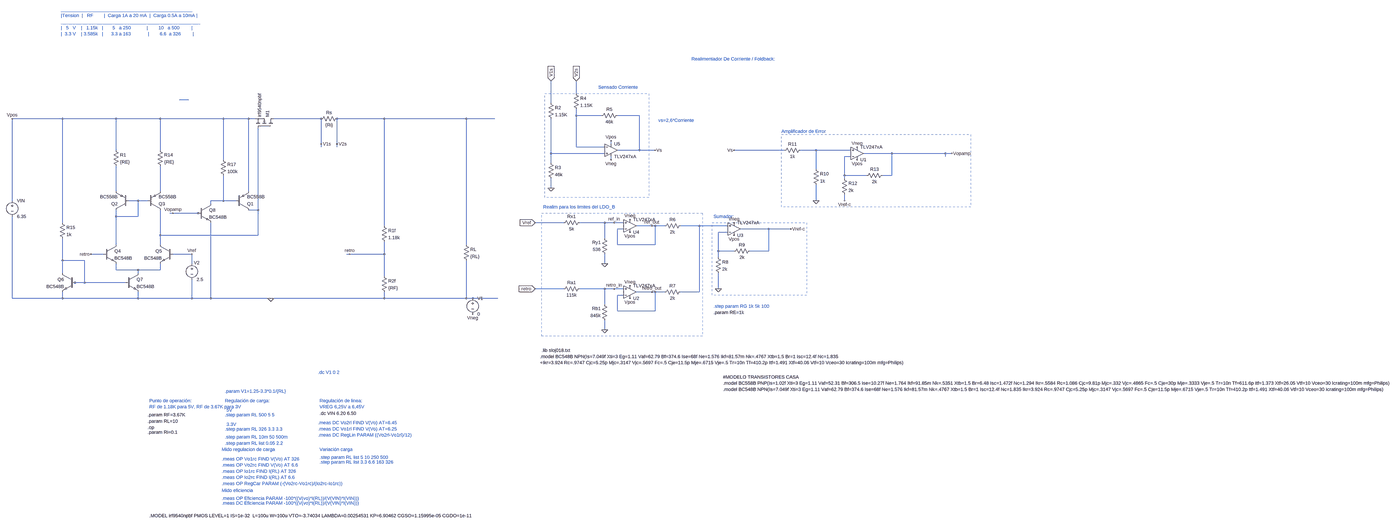
[diagram p0: schematic 2024-09-15 LDO con opamps TLV.asc, whole sheet]
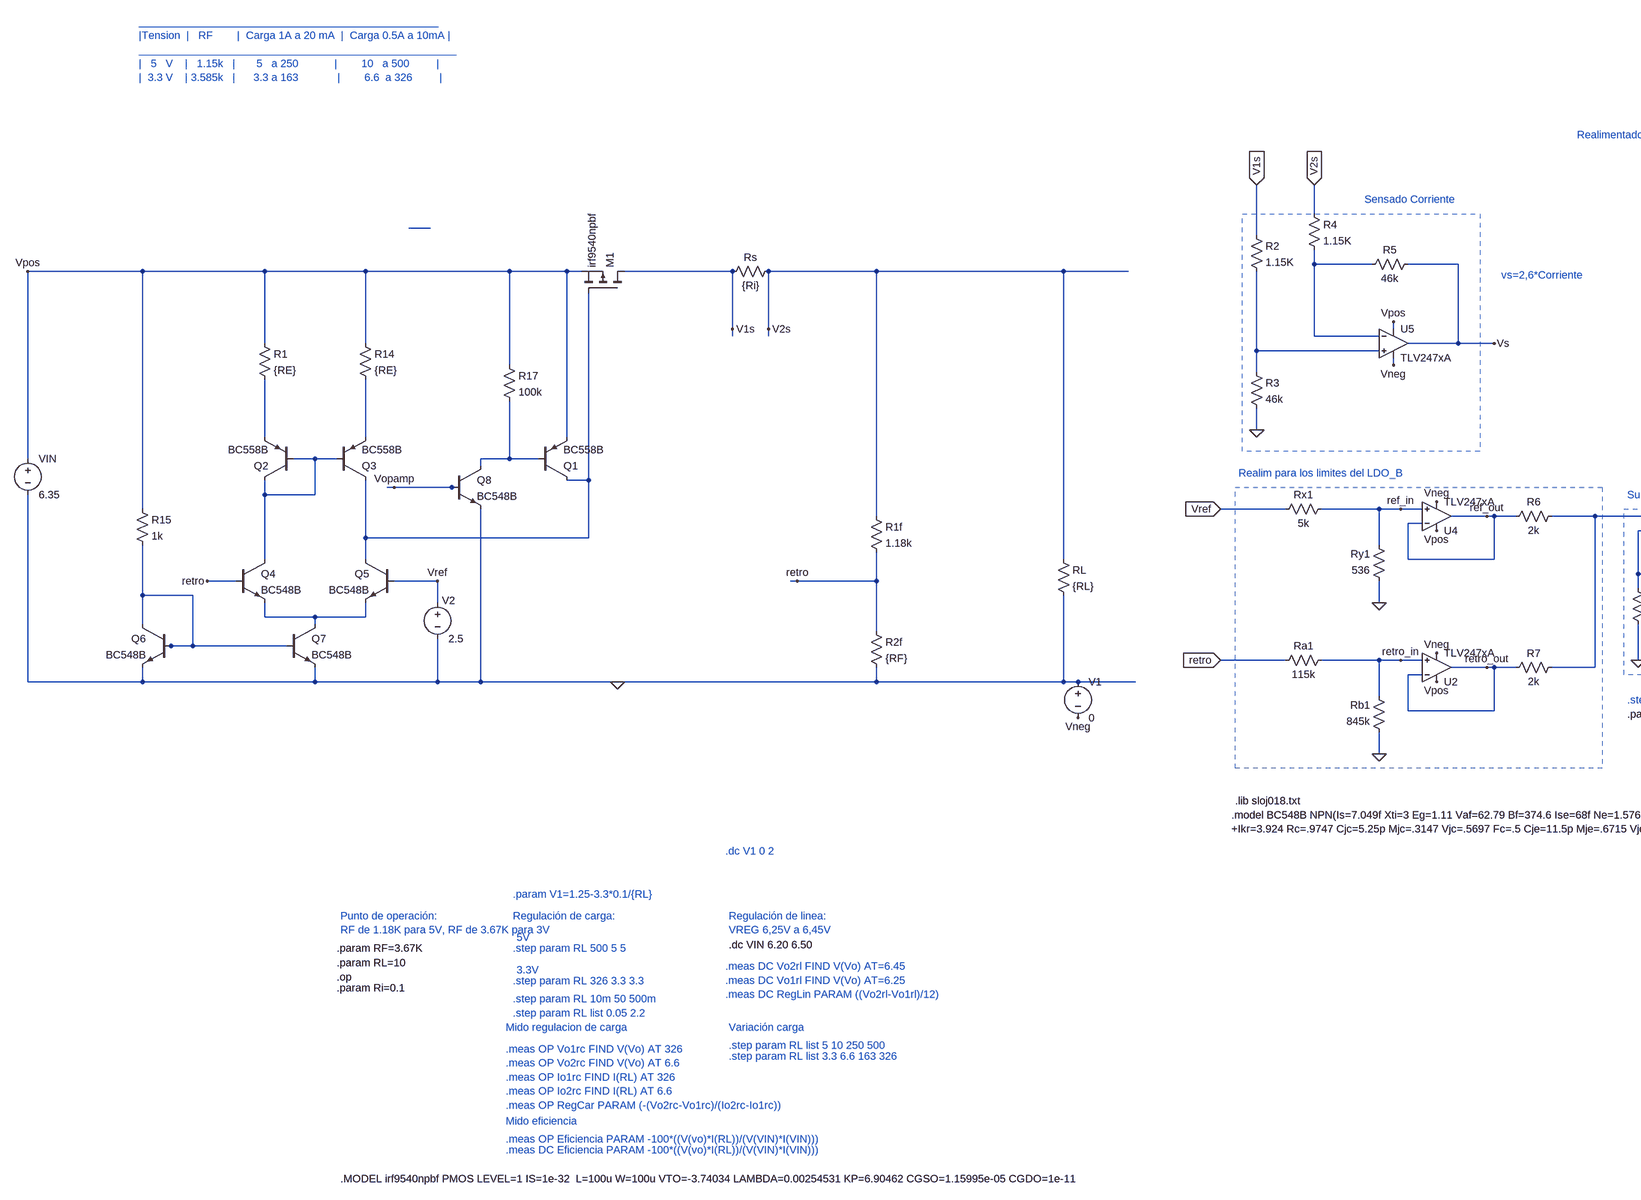
[diagram p1: schematic 2024-09-15 LDO con opamps TLV.asc, part, row 1 of 1, column 1 of 2]
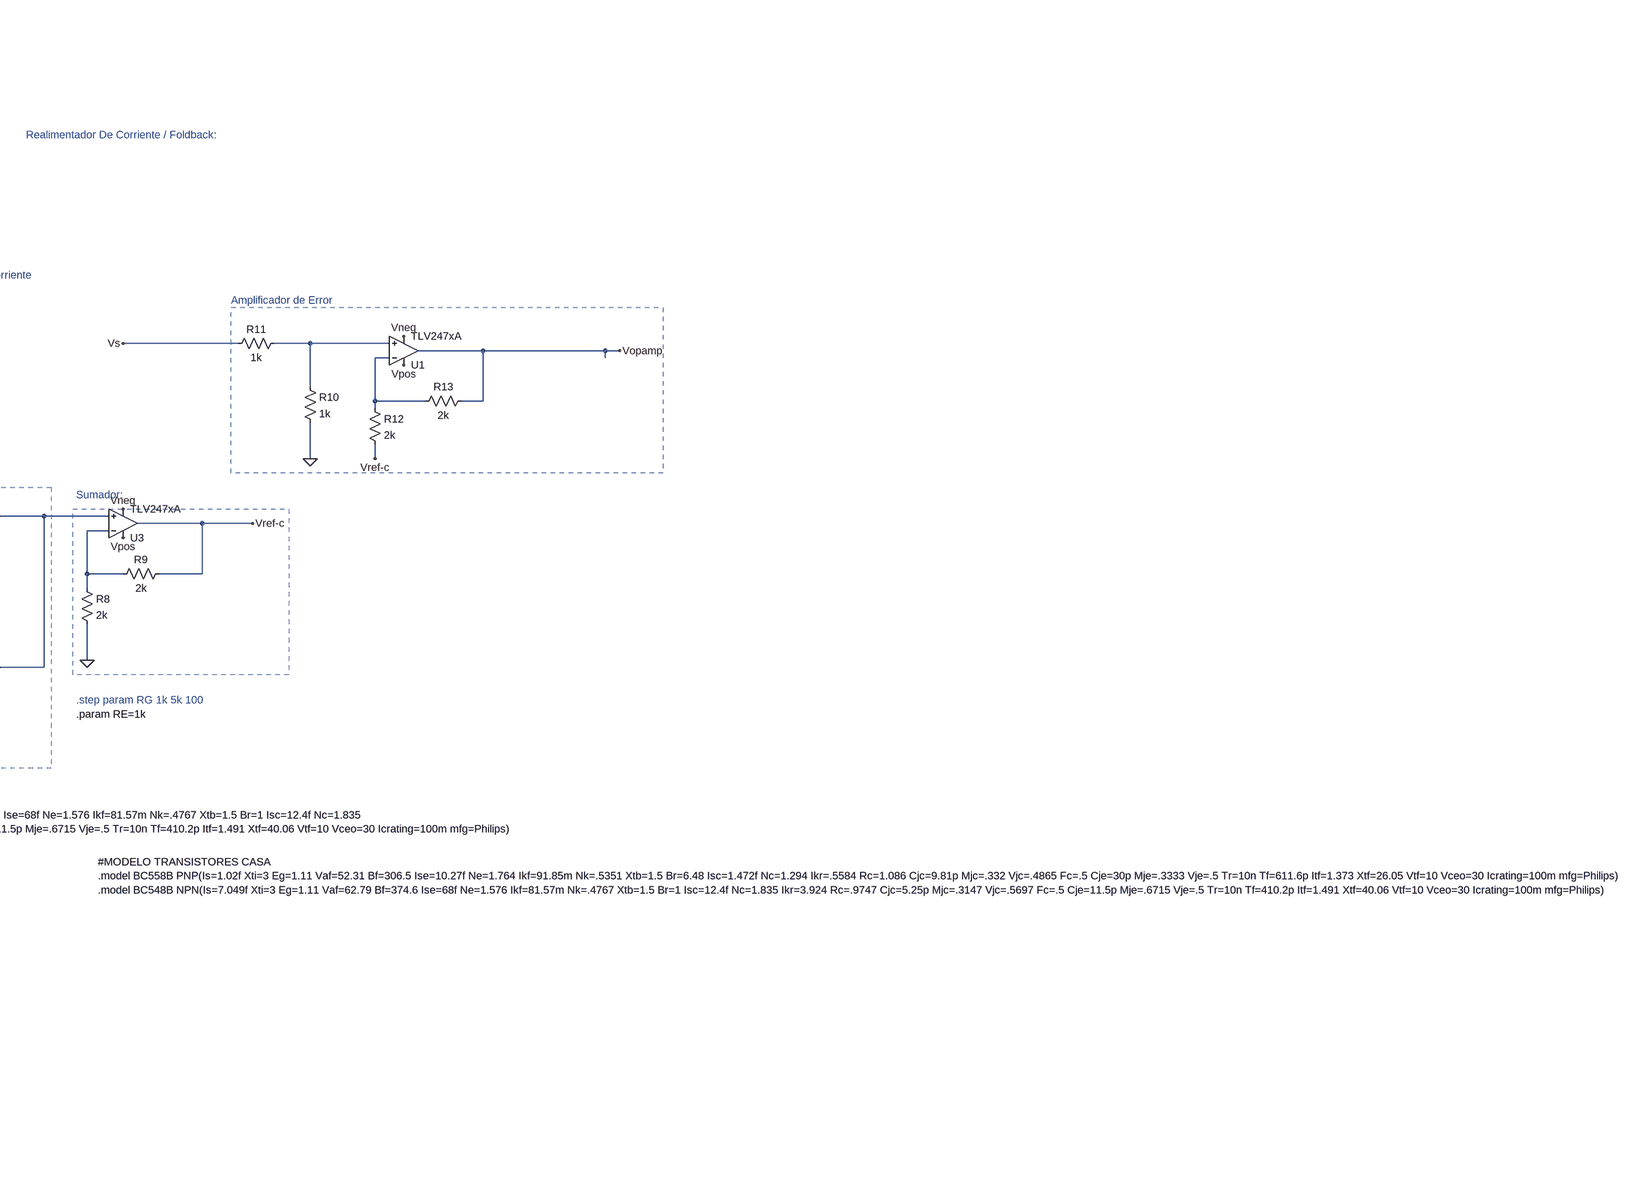
[diagram p2: schematic 2024-09-15 LDO con opamps TLV.asc, part, row 1 of 1, column 2 of 2]
2024-09-15 LDO con opamps TLV.asc, the LTspice schematic file:
Version 4
SHEET 1 6696 2000
WIRE 2176 -160 2176 -224
WIRE 144 -128 96 -128
WIRE 2048 -112 2048 -224
WIRE 2176 -48 2176 -80
WIRE 2304 -48 2176 -48
WIRE 2496 -48 2384 -48
WIRE -496 -32 -784 -32
WIRE -224 -32 -496 -32
WIRE 0 -32 -224 -32
WIRE 320 -32 0 -32
WIRE 448 -32 320 -32
WIRE 480 -32 448 -32
WIRE 816 -32 576 -32
WIRE 1136 -32 896 -32
WIRE 1552 -32 1136 -32
WIRE 1696 -32 1552 -32
WIRE 816 96 816 -32
WIRE 896 96 896 -32
WIRE 2352 96 2352 80
WIRE 816 112 816 96
WIRE 896 112 896 96
WIRE 2176 112 2176 -48
WIRE 2320 112 2176 112
WIRE -224 128 -224 -32
WIRE 0 128 0 -32
WIRE 2496 128 2496 -48
WIRE 2496 128 2384 128
WIRE 2576 128 2496 128
WIRE 3232 128 2976 128
WIRE 3392 128 3312 128
WIRE 3568 128 3392 128
WIRE 2048 144 2048 -32
WIRE 2320 144 2048 144
WIRE 3776 144 3632 144
WIRE 4048 144 3776 144
WIRE 4080 144 4048 144
WIRE 3568 160 3536 160
WIRE 4048 160 4048 144
WIRE 320 176 320 -32
WIRE 2352 176 2352 160
WIRE 2048 192 2048 144
WIRE 3392 224 3392 128
WIRE 3536 256 3536 160
WIRE 3648 256 3536 256
WIRE 3776 256 3776 144
WIRE 3776 256 3728 256
WIRE 3536 272 3536 256
WIRE 2048 320 2048 272
WIRE -224 336 -224 208
WIRE 0 336 0 208
WIRE 448 336 448 -32
WIRE -784 384 -784 -32
WIRE -112 384 -160 384
WIRE -64 384 -112 384
WIRE 320 384 320 256
WIRE 320 384 256 384
WIRE 384 384 320 384
WIRE 3392 384 3392 304
WIRE 3536 384 3536 352
WIRE 256 400 256 384
WIRE 496 432 496 16
WIRE 496 432 448 432
WIRE 64 448 48 448
WIRE 192 448 64 448
WIRE 208 448 192 448
WIRE -224 464 -224 432
WIRE -112 464 -112 384
WIRE -112 464 -224 464
WIRE -496 496 -496 -32
WIRE 2112 496 1968 496
WIRE 2320 496 2192 496
WIRE 2368 496 2320 496
WIRE 2416 496 2368 496
WIRE 1136 512 1136 -32
WIRE 2560 512 2480 512
WIRE 2576 512 2560 512
WIRE 2624 512 2576 512
WIRE 2800 512 2704 512
WIRE 2944 512 2800 512
WIRE 2416 528 2384 528
WIRE 3152 528 3008 528
WIRE 3264 528 3152 528
WIRE 2944 544 2896 544
WIRE 0 560 0 432
WIRE 496 560 496 432
WIRE 496 560 0 560
WIRE 2320 576 2320 496
WIRE -224 608 -224 464
WIRE 0 608 0 560
WIRE 1552 608 1552 -32
WIRE 2384 608 2384 528
WIRE 2576 608 2576 512
WIRE 2576 608 2384 608
WIRE 2896 640 2896 544
WIRE 2976 640 2896 640
WIRE 3152 640 3152 528
WIRE 3152 640 3056 640
WIRE -288 656 -352 656
WIRE 160 656 64 656
WIRE 960 656 944 656
WIRE 1136 656 1136 592
WIRE 1136 656 960 656
WIRE 2896 672 2896 640
WIRE -496 688 -496 576
WIRE -384 688 -496 688
WIRE 160 704 160 656
WIRE 2320 704 2320 656
WIRE -224 736 -224 704
WIRE -112 736 -224 736
WIRE 0 736 0 704
WIRE 0 736 -112 736
WIRE -496 752 -496 688
WIRE -112 752 -112 736
WIRE 1136 768 1136 656
WIRE -432 800 -448 800
WIRE -384 800 -384 688
WIRE -384 800 -432 800
WIRE -176 800 -384 800
WIRE 2112 832 1968 832
WIRE 2320 832 2192 832
WIRE 2368 832 2320 832
WIRE 2416 832 2368 832
WIRE 2896 832 2896 752
WIRE 2560 848 2480 848
WIRE 2576 848 2560 848
WIRE 2624 848 2576 848
WIRE 2800 848 2800 512
WIRE 2800 848 2704 848
WIRE 2416 864 2384 864
WIRE -784 880 -784 464
WIRE -496 880 -496 848
WIRE -496 880 -784 880
WIRE -112 880 -112 848
WIRE -112 880 -496 880
WIRE 160 880 160 784
WIRE 160 880 -112 880
WIRE 256 880 256 496
WIRE 256 880 160 880
WIRE 560 880 256 880
WIRE 1136 880 1136 848
WIRE 1136 880 560 880
WIRE 1552 880 1552 688
WIRE 1552 880 1136 880
WIRE 1584 880 1552 880
WIRE 1712 880 1584 880
WIRE 2320 912 2320 832
WIRE 2384 944 2384 864
WIRE 2576 944 2576 848
WIRE 2576 944 2384 944
WIRE 2320 1040 2320 992
FLAG 560 880 0
FLAG -784 -32 Vpos
FLAG 960 656 retro
FLAG 2576 128 Vs
FLAG 2048 -224 V1s
IOPIN 2048 -224 In
FLAG 2176 -224 V2s
IOPIN 2176 -224 In
FLAG 1968 496 Vref
IOPIN 1968 496 In
FLAG 1968 832 retro
IOPIN 1968 832 In
FLAG 3264 528 Vref-c
FLAG 3536 384 Vref-c
FLAG 2352 80 Vpos
FLAG 3600 176 Vpos
FLAG 2976 560 Vpos
FLAG 2448 544 Vpos
FLAG 2448 880 Vpos
FLAG 2352 176 Vneg
FLAG 3600 112 Vneg
FLAG 2976 496 Vneg
FLAG 2448 816 Vneg
FLAG 2448 480 Vneg
FLAG 816 96 V1s
FLAG 896 96 V2s
FLAG 1584 960 Vneg
FLAG 2368 496 ref_in
FLAG 2368 832 retro_in
FLAG 2560 848 retro_out
FLAG 2560 512 ref_out
FLAG 160 656 Vref
FLAG 4080 144 Vopamp
FLAG -352 656 retro
FLAG 2976 128 Vs
FLAG 64 448 Vopamp
FLAG 2048 320 0
FLAG 2320 1040 0
FLAG 2896 832 0
FLAG 3392 384 0
FLAG 2320 704 0
DATAFLAG 1040 -32 ""
DATAFLAG 96 -32 ""
SYMBOL res 1536 592 R0
SYMATTR InstName RL
SYMATTR Value {RL}
SYMBOL voltage -784 368 R0
WINDOW 123 24 124 Left 2
WINDOW 39 0 0 Left 0
SYMATTR InstName VIN
SYMATTR Value 6.35
SYMBOL res 1120 496 R0
SYMATTR InstName R1f
SYMATTR Value 1.18k
SYMBOL res 1120 752 R0
SYMATTR InstName R2f
SYMATTR Value {RF}
SYMBOL res 912 -48 R90
WINDOW 0 0 56 VBottom 2
WINDOW 3 32 56 VTop 2
SYMATTR InstName Rs
SYMATTR Value {Ri}
SYMBOL Res 2032 -128 R0
SYMATTR InstName R2
SYMATTR Value 1.15K
SYMBOL Res 2032 176 R0
SYMATTR InstName R3
SYMATTR Value 46k
SYMBOL Res 2160 -176 R0
SYMATTR InstName R4
SYMATTR Value 1.15K
SYMBOL Res 2400 -64 R90
WINDOW 0 0 56 VBottom 2
WINDOW 3 32 56 VTop 2
SYMATTR InstName R5
SYMATTR Value 46k
SYMBOL Res 2208 480 R90
WINDOW 0 0 56 VBottom 2
WINDOW 3 32 56 VTop 2
SYMATTR InstName Rx1
SYMATTR Value 5k
SYMBOL Res 2336 672 R180
WINDOW 0 36 76 Left 2
WINDOW 3 36 40 Left 2
SYMATTR InstName Ry1
SYMATTR Value 536
SYMBOL Res 2208 816 R90
WINDOW 0 0 56 VBottom 2
WINDOW 3 32 56 VTop 2
SYMATTR InstName Ra1
SYMATTR Value 115k
SYMBOL Res 2336 1008 R180
WINDOW 0 36 76 Left 2
WINDOW 3 36 40 Left 2
SYMATTR InstName Rb1
SYMATTR Value 845k
SYMBOL Res 2720 496 R90
WINDOW 0 0 56 VBottom 2
WINDOW 3 32 56 VTop 2
SYMATTR InstName R6
SYMATTR Value 2k
SYMBOL Res 2720 832 R90
WINDOW 0 0 56 VBottom 2
WINDOW 3 32 56 VTop 2
SYMATTR InstName R7
SYMATTR Value 2k
SYMBOL Res 2880 656 R0
SYMATTR InstName R8
SYMATTR Value 2k
SYMBOL Res 3072 624 R90
WINDOW 0 0 56 VBottom 2
WINDOW 3 32 56 VTop 2
SYMATTR InstName R9
SYMATTR Value 2k
SYMBOL Res 3376 208 R0
SYMATTR InstName R10
SYMATTR Value 1k
SYMBOL Res 3328 112 R90
WINDOW 0 0 56 VBottom 2
WINDOW 3 32 56 VTop 2
SYMATTR InstName R11
SYMATTR Value 1k
SYMBOL Res 3520 256 R0
SYMATTR InstName R12
SYMATTR Value 2k
SYMBOL Res 3744 240 R90
WINDOW 0 0 56 VBottom 2
WINDOW 3 32 56 VTop 2
SYMATTR InstName R13
SYMATTR Value 2k
SYMBOL pnp -160 432 R180
SYMATTR InstName Q2
SYMATTR Value BC558B
SYMBOL pnp -64 432 M180
SYMATTR InstName Q3
SYMATTR Value BC558B
SYMBOL npn -288 608 R0
SYMATTR InstName Q4
SYMATTR Value BC548B
SYMBOL npn 64 608 M0
SYMATTR InstName Q5
SYMATTR Value BC548B
SYMBOL res -240 112 R0
SYMATTR InstName R1
SYMATTR Value {RE}
SYMBOL res -16 112 R0
SYMATTR InstName R14
SYMATTR Value {RE}
SYMBOL res -512 480 R0
SYMATTR InstName R15
SYMATTR Value 1k
SYMBOL npn -432 752 M0
SYMATTR InstName Q6
SYMATTR Value BC548B
SYMBOL npn -176 752 R0
SYMATTR InstName Q7
SYMATTR Value BC548B
SYMBOL pmos 576 16 M270
SYMATTR InstName M1
SYMATTR Value irf9540npbf
SYMBOL voltage 160 688 R0
WINDOW 0 10 11 Left 2
SYMATTR InstName V2
SYMATTR Value 2.5
SYMBOL pnp 384 432 M180
SYMATTR InstName Q1
SYMATTR Value BC558B
SYMBOL npn 192 400 R0
SYMATTR InstName Q8
SYMATTR Value BC548B
SYMBOL res 304 160 R0
SYMATTR InstName R17
SYMATTR Value 100k
SYMBOL voltage 1584 864 R0
WINDOW 123 0 0 Left 0
WINDOW 39 0 0 Left 0
SYMATTR InstName V1
SYMATTR Value 0
SYMBOL opamp2 2976 592 M180
SYMATTR InstName U3
SYMATTR Value TLV247xA
SYMBOL opamp2 2448 912 M180
SYMATTR InstName U2
SYMATTR Value TLV247xA
SYMBOL opamp2 2448 576 M180
SYMATTR InstName U4
SYMATTR Value TLV247xA
SYMBOL opamp2 2352 64 R0
SYMATTR InstName U5
SYMATTR Value TLV247xA
SYMBOL opamp2 3600 208 M180
SYMATTR InstName U1
SYMATTR Value TLV247xA
TEXT -64 1536 Left 2 !.op
TEXT 808 1464 Left 2 !.dc VIN 6.20 6.50
TEXT 328 1472 Left 2 ;.step param RL 500 5 5
TEXT -56 1984 Left 2 !.MODEL irf9540npbf PMOS LEVEL=1 IS=1e-32  L=100u W=100u VTO=-3.74034 LAMBDA=0.00254531 KP=6.90462 CGSO=1.15995e-05 CGDO=1e-11
TEXT -64 1504 Left 2 !.param RL=10
TEXT 328 1400 Left 2 ;Regulación de carga:
TEXT 808 1400 Left 2 ;Regulación de linea:\nVREG 6,25V a 6,45V
TEXT 808 1688 Left 2 ;.step param RL list 5 10 250 500
TEXT -64 1472 Left 2 !.param RF=3.67K
TEXT -56 1400 Left 2 ;Punto de operación:\nRF de 1.18K para 5V, RF de 3.67K para 3V
TEXT 800 1512 Left 2 ;.meas DC Vo2rl FIND V(Vo) AT=6.45\n.meas DC Vo1rl FIND V(Vo) AT=6.25\n.meas DC RegLin PARAM ((Vo2rl-Vo1rl)/12)
TEXT 336 1448 Left 2 ;5V
TEXT 336 1520 Left 2 ;3.3V
TEXT 328 1544 Left 2 ;.step param RL 326 3.3 3.3
TEXT 312 1696 Left 2 ;.meas OP Vo1rc FIND V(Vo) AT 326\n.meas OP Vo2rc FIND V(Vo) AT 6.6\n.meas OP Io1rc FIND I(RL) AT 326\n.meas OP Io2rc FIND I(RL) AT 6.6\n.meas OP RegCar PARAM (-(Vo2rc-Vo1rc)/(Io2rc-Io1rc))
TEXT 312 1856 Left 2 ;Mido eficiencia
TEXT 312 1896 Left 2 ;.meas OP Eficiencia PARAM -100*((V(vo)*I(RL))/(V(VIN)*I(VIN)))
TEXT 312 1648 Left 2 ;Mido regulacion de carga
TEXT 808 1648 Left 2 ;Variación carga
TEXT -504 -616 Left 2 ;__________________________________________________\n|Tension  |   RF        |  Carga 1A a 20 mA  |  Carga 0.5A a 10mA |\n_____________________________________________________\n|   5   V    |   1.15k   |       5   a 250            |        10   a 500         |\n|  3.3 V    | 3.585k   |      3.3 a 163             |        6.6  a 326         |
TEXT 808 1712 Left 2 ;.step param RL list 3.3 6.6 163 326
TEXT 312 1920 Left 2 ;.meas DC Eficiencia PARAM -100*((V(vo)*I(RL))/(V(VIN)*I(VIN)))
TEXT -64 1560 Left 2 !.param Ri=0.1
TEXT 328 1584 Left 2 ;.step param RL 10m 50 500m
TEXT 2760 -336 Left 2 ;Realimentador De Corriente / Foldback:
TEXT 2288 -192 Left 2 ;Sensado Corriente
TEXT 2008 416 Left 2 ;Realim para los limites del LDO_B
TEXT 2872 464 Left 2 ;Sumador:
TEXT 3216 32 Left 2 ;Amplificador de Error
TEXT 1992 1176 Left 2 !.model BC548B NPN(Is=7.049f Xti=3 Eg=1.11 Vaf=62.79 Bf=374.6 Ise=68f Ne=1.576 Ikf=81.57m Nk=.4767 Xtb=1.5 Br=1 Isc=12.4f Nc=1.835\n+Ikr=3.924 Rc=.9747 Cjc=5.25p Mjc=.3147 Vjc=.5697 Fc=.5 Cje=11.5p Mje=.6715 Vje=.5 Tr=10n Tf=410.2p Itf=1.491 Xtf=40.06 Vtf=10 Vceo=30 Icrating=100m mfg=Philips)
TEXT 2000 1144 Left 2 !.lib sloj018.txt
TEXT 2872 920 Left 2 ;.step param RG 1k 5k 100
TEXT 2872 952 Left 2 !.param RE=1k
TEXT 2920 1280 Left 2 !#MODELO TRANSISTORES CASA\n.model BC558B PNP(Is=1.02f Xti=3 Eg=1.11 Vaf=52.31 Bf=306.5 Ise=10.27f Ne=1.764 Ikf=91.85m Nk=.5351 Xtb=1.5 Br=6.48 Isc=1.472f Nc=1.294 Ikr=.5584 Rc=1.086 Cjc=9.81p Mjc=.332 Vjc=.4865 Fc=.5 Cje=30p Mje=.3333 Vje=.5 Tr=10n Tf=611.6p Itf=1.373 Xtf=26.05 Vtf=10 Vceo=30 Icrating=100m mfg=Philips)\n.model BC548B NPN(Is=7.049f Xti=3 Eg=1.11 Vaf=62.79 Bf=374.6 Ise=68f Ne=1.576 Ikf=81.57m Nk=.4767 Xtb=1.5 Br=1 Isc=12.4f Nc=1.835 Ikr=3.924 Rc=.9747 Cjc=5.25p Mjc=.3147 Vjc=.5697 Fc=.5 Cje=11.5p Mje=.6715 Vje=.5 Tr=10n Tf=410.2p Itf=1.491 Xtf=40.06 Vtf=10 Vceo=30 Icrating=100m mfg=Philips)
TEXT 800 1256 Left 2 ;.dc V1 0 2
TEXT 328 1352 Left 2 ;.param V1=1.25-3.3*0.1/{RL}
TEXT 328 1616 Left 2 ;.step param RL list 0.05 2.2
TEXT 2592 -24 Left 2 ;vs=2,6*Corriente
RECTANGLE Normal 3344 864 2864 496 2
RECTANGLE Normal 2816 1072 2000 448 2
RECTANGLE Normal 4176 416 3216 48 2
RECTANGLE Normal 2544 368 2016 -160 2

The netlist it stands for:
* 2024-09-15 LDO con opamps TLV.asc
RL V2s 0 {RL}
VIN Vpos 0 6.35
R1f V2s retro 1.18k
R2f retro 0 {RF}
Rs V2s V1s {Ri}
R2 V1s N004 1.15K
R3 N004 0 46k
R4 V2s N002 1.15K
R5 Vs N002 46k
Rx1 ref_in Vref 5k
Ry1 0 ref_in 536
Ra1 retro_in retro 115k
Rb1 0 retro_in 845k
R6 N011 ref_out 2k
R7 N011 retro_out 2k
R8 N012 0 2k
R9 Vref-c N012 2k
R10 N003 0 1k
R11 N003 Vs 1k
R12 N005 Vref-c 2k
R13 Vopamp N005 2k
Q2 N008 N008 N006 0 BC558B
Q3 N010 N008 N007 0 BC558B
Q4 N008 retro N014 0 BC548B
Q5 N010 Vref N014 0 BC548B
R1 Vpos N006 {RE}
R14 Vpos N007 {RE}
R15 Vpos N013 1k
Q6 N013 N013 0 0 BC548B
Q7 N014 N013 0 0 BC548B
M1 V1s N010 Vpos Vpos irf9540npbf
V2 Vref 0 2.5
Q1 N010 N009 Vpos 0 BC558B
Q8 N009 Vopamp 0 0 BC548B
R17 Vpos N009 100k
V1 0 Vneg 0
XU3 N011 N012 Vpos Vneg Vref-c TLV247xA  ; pins In+ In- V+ V- OUT
XU2 retro_in retro_out Vpos Vneg retro_out TLV247xA  ; pins In+ In- V+ V- OUT
XU4 ref_in ref_out Vpos Vneg ref_out TLV247xA  ; pins In+ In- V+ V- OUT
XU5 N004 N002 Vpos Vneg Vs TLV247xA  ; pins In+ In- V+ V- OUT
XU1 N003 N005 Vpos Vneg Vopamp TLV247xA  ; pins In+ In- V+ V- OUT
.model NPN NPN
.model PNP PNP
.lib standard.bjt
.model NMOS NMOS
.model PMOS PMOS
.lib standard.mos
.op
.dc VIN 6.20 6.50
* .step param RL 500 5 5
.MODEL irf9540npbf PMOS LEVEL=1 IS=1e-32  L=100u W=100u VTO=-3.74034 LAMBDA=0.00254531 KP=6.90462 CGSO=1.15995e-05 CGDO=1e-11
.param RL=10
* Regulación de carga:
* Regulación de linea:
* VREG 6,25V a 6,45V
* .step param RL list 5 10 250 500
.param RF=3.67K
* Punto de operación:
* RF de 1.18K para 5V, RF de 3.67K para 3V
* .meas DC Vo2rl FIND V(Vo) AT=6.45
* .meas DC Vo1rl FIND V(Vo) AT=6.25
* .meas DC RegLin PARAM ((Vo2rl-Vo1rl)/12)
* 5V
* 3.3V
* .step param RL 326 3.3 3.3
* .meas OP Vo1rc FIND V(Vo) AT 326
* .meas OP Vo2rc FIND V(Vo) AT 6.6
* .meas OP Io1rc FIND I(RL) AT 326
* .meas OP Io2rc FIND I(RL) AT 6.6
* .meas OP RegCar PARAM (-(Vo2rc-Vo1rc)/(Io2rc-Io1rc))
* Mido eficiencia
* .meas OP Eficiencia PARAM -100*((V(vo)*I(RL))/(V(VIN)*I(VIN)))
* Mido regulacion de carga
* Variación carga
* __________________________________________________
* |Tension  |   RF        |  Carga 1A a 20 mA  |  Carga 0.5A a 10mA |
* _____________________________________________________
* |   5   V    |   1.15k   |       5   a 250            |        10   a 500         |
* |  3.3 V    | 3.585k   |      3.3 a 163             |        6.6  a 326         |
* .step param RL list 3.3 6.6 163 326
* .meas DC Eficiencia PARAM -100*((V(vo)*I(RL))/(V(VIN)*I(VIN)))
.param Ri=0.1
* .step param RL 10m 50 500m
* Realimentador De Corriente / Foldback:
* Sensado Corriente
* Realim para los limites del LDO_B
* Sumador:
* Amplificador de Error
.model BC548B NPN(Is=7.049f Xti=3 Eg=1.11 Vaf=62.79 Bf=374.6 Ise=68f Ne=1.576 Ikf=81.57m Nk=.4767 Xtb=1.5 Br=1 Isc=12.4f Nc=1.835
+Ikr=3.924 Rc=.9747 Cjc=5.25p Mjc=.3147 Vjc=.5697 Fc=.5 Cje=11.5p Mje=.6715 Vje=.5 Tr=10n Tf=410.2p Itf=1.491 Xtf=40.06 Vtf=10 Vceo=30 Icrating=100m mfg=Philips)
.lib sloj018.txt
* .step param RG 1k 5k 100
.param RE=1k
#MODELO TRANSISTORES CASA
.model BC558B PNP(Is=1.02f Xti=3 Eg=1.11 Vaf=52.31 Bf=306.5 Ise=10.27f Ne=1.764 Ikf=91.85m Nk=.5351 Xtb=1.5 Br=6.48 Isc=1.472f Nc=1.294 Ikr=.5584 Rc=1.086 Cjc=9.81p Mjc=.332 Vjc=.4865 Fc=.5 Cje=30p Mje=.3333 Vje=.5 Tr=10n Tf=611.6p Itf=1.373 Xtf=26.05 Vtf=10 Vceo=30 Icrating=100m mfg=Philips)
.model BC548B NPN(Is=7.049f Xti=3 Eg=1.11 Vaf=62.79 Bf=374.6 Ise=68f Ne=1.576 Ikf=81.57m Nk=.4767 Xtb=1.5 Br=1 Isc=12.4f Nc=1.835 Ikr=3.924 Rc=.9747 Cjc=5.25p Mjc=.3147 Vjc=.5697 Fc=.5 Cje=11.5p Mje=.6715 Vje=.5 Tr=10n Tf=410.2p Itf=1.491 Xtf=40.06 Vtf=10 Vceo=30 Icrating=100m mfg=Philips)
* .dc V1 0 2
* .param V1=1.25-3.3*0.1/{RL}
* .step param RL list 0.05 2.2
* vs=2,6*Corriente
.backanno
.end

* Results of the author's LTspice run, read from the files saved beside the schematic
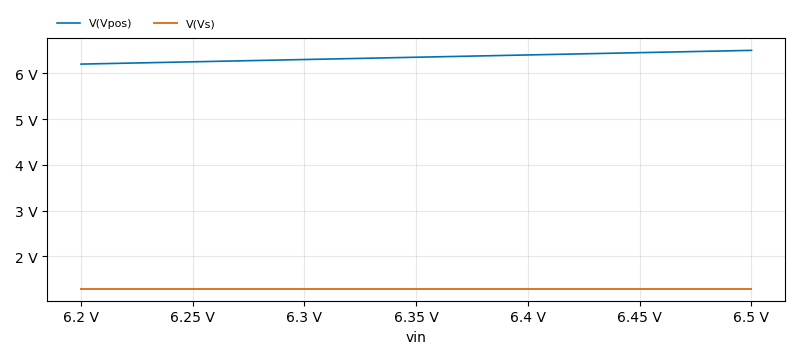
[diagram p3: DC transfer characteristic of 2024-09-15 LDO con opamps TLV.asc, plotted from the saved traces]
* DC transfer characteristic, 1 run:
*   V(Vpos): 6.2 V at vin=6.2 V, 6.5 V at vin=6.5 V, min 6.2 V, max 6.5 V
*   V(Vs): 1.292 V at vin=6.2 V, 1.294 V at vin=6.5 V, min 1.292 V, max 1.294 V
* From the log:
*   Semiconductor Device Operating Points:
*                           --- Diodes ---
*   Name:    d:u3:c      d:u3:e      d:u3:lp     d:u3:ln     d:u3:p
*   Model:    u3:dy       u3:dy       u3:dx       u3:dx       u3:dx
*   Id:     -5.16e-12    1.33e-06   -1.10e-10   -1.10e-10   -6.35e-12
*   Vd:     -5.22e+00    5.49e-01   -1.10e+02   -1.10e+02   -6.35e+00
*   Req:     1.00e+12    1.95e+04    1.00e+12    1.00e+12    1.00e+12
*   CAP:     4.01e-12    1.48e-11    0.00e+00    0.00e+00    0.00e+00
*   Name:    d:u2:c      d:u2:e      d:u2:lp     d:u2:ln     d:u2:p
*   Model:    u2:dy       u2:dy       u2:dx       u2:dx       u2:dx
*   Id:     -5.45e-12    1.54e-02   -1.25e-10   -9.46e-11   -6.35e-12
*   Vd:     -5.46e+00    7.91e-01   -1.25e+02   -9.46e+01   -6.35e+00
*   Req:     1.00e+12    1.68e+00    1.00e+12    1.00e+12    1.00e+12
*   CAP:     3.94e-12    1.83e-11    0.00e+00    0.00e+00    0.00e+00
*   Name:    d:u4:c      d:u4:e      d:u4:lp     d:u4:ln     d:u4:p
*   Model:    u4:dy       u4:dy       u4:dx       u4:dx       u4:dx
*   Id:     -5.22e-12    9.48e-06   -1.10e-10   -1.10e-10   -6.35e-12
*   Vd:     -5.27e+00    6.00e-01   -1.10e+02   -1.10e+02   -6.35e+00
*   Req:     1.00e+12    2.73e+03    1.00e+12    1.00e+12    1.00e+12
*   CAP:     3.99e-12    1.56e-11    0.00e+00    0.00e+00    0.00e+00
*   Name:    d:u5:c      d:u5:e      d:u5:lp     d:u5:ln     d:u5:p
*   Model:    u5:dy       u5:dy       u5:dx       u5:dx       u5:dx
*   Id:     -4.55e-12    0.00e+00   -1.10e-10   -1.10e-10   -6.35e-12
*   Vd:     -4.65e+00   -1.92e-02   -1.10e+02   -1.10e+02   -6.35e+00
*   Req:     1.00e+12    9.85e+11    1.00e+12    1.00e+12    1.00e+12
*   CAP:     4.21e-12    9.91e-12    0.00e+00    0.00e+00    0.00e+00
*   Name:    d:u1:c      d:u1:e      d:u1:lp     d:u1:ln     d:u1:p
*   Model:    u1:dy       u1:dy       u1:dx       u1:dx       u1:dx
*   Id:     -4.88e-12    3.20e-11   -1.10e-10   -1.10e-10   -6.35e-12
*   Vd:     -4.94e+00    2.74e-01   -1.10e+02   -1.10e+02   -6.35e+00
*   Req:     1.00e+12    8.13e+08    1.00e+12    1.00e+12    1.00e+12
*   CAP:     4.10e-12    1.17e-11    0.00e+00    0.00e+00    0.00e+00
*                           --- Bipolar Transistors ---
*   Name:       q2          q3          q1          q4          q5
*   Model:    bc558b      bc558b      bc558b      bc548b      bc548b
*   Ib:      -1.70e-12    2.06e-12   -1.87e-05   -7.89e-12    1.87e-05
*   Ic:      -6.45e-12   -1.07e-11   -5.68e-03    6.09e-12    5.68e-03
*   Vbe:     -2.26e-01   -2.26e-01   -7.59e-01   -1.74e+00    7.11e-01
*   Vbc:      0.00e+00    3.76e+00    3.23e+00   -6.07e+00    1.38e-01
*   Vce:     -2.26e-01   -3.99e+00   -3.99e+00    4.33e+00    5.73e-01
*   BetaDC:   3.78e+00   -5.18e+00    3.03e+02   -7.72e-01    3.03e+02
*   Gm:       2.49e-10    2.67e-10    2.07e-01    2.17e-42    2.07e-01
*   Rpi:      2.95e+10    2.95e+10    1.39e+03    1.00e+12    1.45e+03
*   Rx:       0.00e+00    0.00e+00    0.00e+00    0.00e+00    0.00e+00
*   Ro:       6.15e+12    8.11e+12    9.78e+03    0.00e+00    1.10e+04
*   Cbe:      3.67e-11    3.67e-11    1.90e-10    4.21e-12    1.26e-10
*   Cbc:      9.81e-12    4.78e-12    5.00e-12    2.42e-12    5.75e-12
*   Cjs:      0.00e+00    0.00e+00    0.00e+00    0.00e+00    0.00e+00
*   BetaAC:   7.34e+00    7.87e+00    2.87e+02    2.17e-30    3.00e+02
*   Cbx:      0.00e+00    0.00e+00    0.00e+00    0.00e+00    0.00e+00
*   Ft:       8.45e-01    1.02e+00    1.69e+08    2.40e-02    2.50e+08
*   Name:       q6          q7          q8
*   Model:    bc548b      bc548b      bc548b
*   Ib:       1.84e-05    1.84e-05    1.42e-07
*   Ic:       5.60e-03    5.70e-03    2.63e-05
*   Vbe:      7.10e-01    7.10e-01    5.68e-01
*   Vbc:      0.00e+00   -1.08e+00   -5.02e+00
*   Vce:      7.10e-01    1.79e+00    5.59e+00
*   BetaDC:   3.04e+02    3.09e+02    1.86e+02
*   Gm:       2.04e-01    2.08e-01    1.02e-03
*   Rpi:      1.48e+03    1.48e+03    2.27e+05
*   Rx:       0.00e+00    0.00e+00    0.00e+00
*   Ro:       1.12e+04    1.12e+04    2.58e+06
*   Cbe:      1.25e-10    1.26e-10    3.44e-11
*   Cbc:      5.27e-12    3.76e-12    2.56e-12
*   Cjs:      0.00e+00    0.00e+00    0.00e+00
*   BetaAC:   3.01e+02    3.06e+02    2.31e+02
*   Cbx:      0.00e+00    0.00e+00    0.00e+00
*   Ft:       2.50e+08    2.54e+08    4.38e+06
*                           --- JFET Transistors ---
*   Name:    j:u3:1      j:u3:2      j:u2:1      j:u2:2      j:u4:1
*   Model:   u3:jx1      u3:jx2      u2:jx1      u2:jx2      u4:jx1
*   Id:      5.30e-06    5.30e-06    5.49e-06    5.10e-06    5.30e-06
*   Vgs:    -9.06e-01   -9.06e-01   -9.04e-01   -9.07e-01   -9.06e-01
*   Vds:     5.23e+00    5.23e+00    5.33e+00    5.33e+00    5.14e+00
*   Gm:      1.12e-04    1.12e-04    1.14e-04    1.10e-04    1.12e-04
*   Gds:     0.00e+00    0.00e+00    0.00e+00    0.00e+00    0.00e+00
*   Cgs:     0.00e+00    0.00e+00    0.00e+00    0.00e+00    0.00e+00
*   Cgd:     0.00e+00    0.00e+00    0.00e+00    0.00e+00    0.00e+00
*   Name:    j:u4:2      j:u5:1      j:u5:2      j:u1:1      j:u1:2
*   Model:   u4:jx2      u5:jx1      u5:jx2      u1:jx1      u1:jx2
*   Id:      5.30e-06    5.30e-06    5.30e-06    5.30e-06    5.31e-06
*   Vgs:    -9.06e-01   -9.06e-01   -9.06e-01   -9.06e-01   -9.05e-01
*   Vds:     5.14e+00    5.25e+00    5.25e+00    4.95e+00    4.95e+00
*   Gm:      1.12e-04    1.12e-04    1.12e-04    1.12e-04    1.12e-04
*   Gds:     0.00e+00    0.00e+00    0.00e+00    0.00e+00    0.00e+00
*   Cgs:     0.00e+00    0.00e+00    0.00e+00    0.00e+00    0.00e+00
*   Cgd:     0.00e+00    0.00e+00    0.00e+00    0.00e+00    0.00e+00
*                           --- MOSFET Transistors ---
*   Name:          m1
*   Model:     irf9540npbf
*   Id:         -2.15e-01
*   Vgs:        -3.99e+00
*   Vds:        -6.22e+00
*   Vbs:         0.00e+00
*   Vth:        -3.74e+00
*   Vdsat:      -2.48e-01
*   Gm:          1.74e+00
*   Gds:         5.39e-04
*   Gmb:         0.00e+00
*   Cbd:         0.00e+00
*   Cbs:         0.00e+00
*   Cgsov:       1.16e-09
*   Cgdov:       1.00e-15
*   Cgbov:       0.00e+00
*   Cgs:         0.00e+00
*   Cgd:         0.00e+00
*   Cgb:         0.00e+00